# Altium schematic sheet USB.SchDoc
size A4
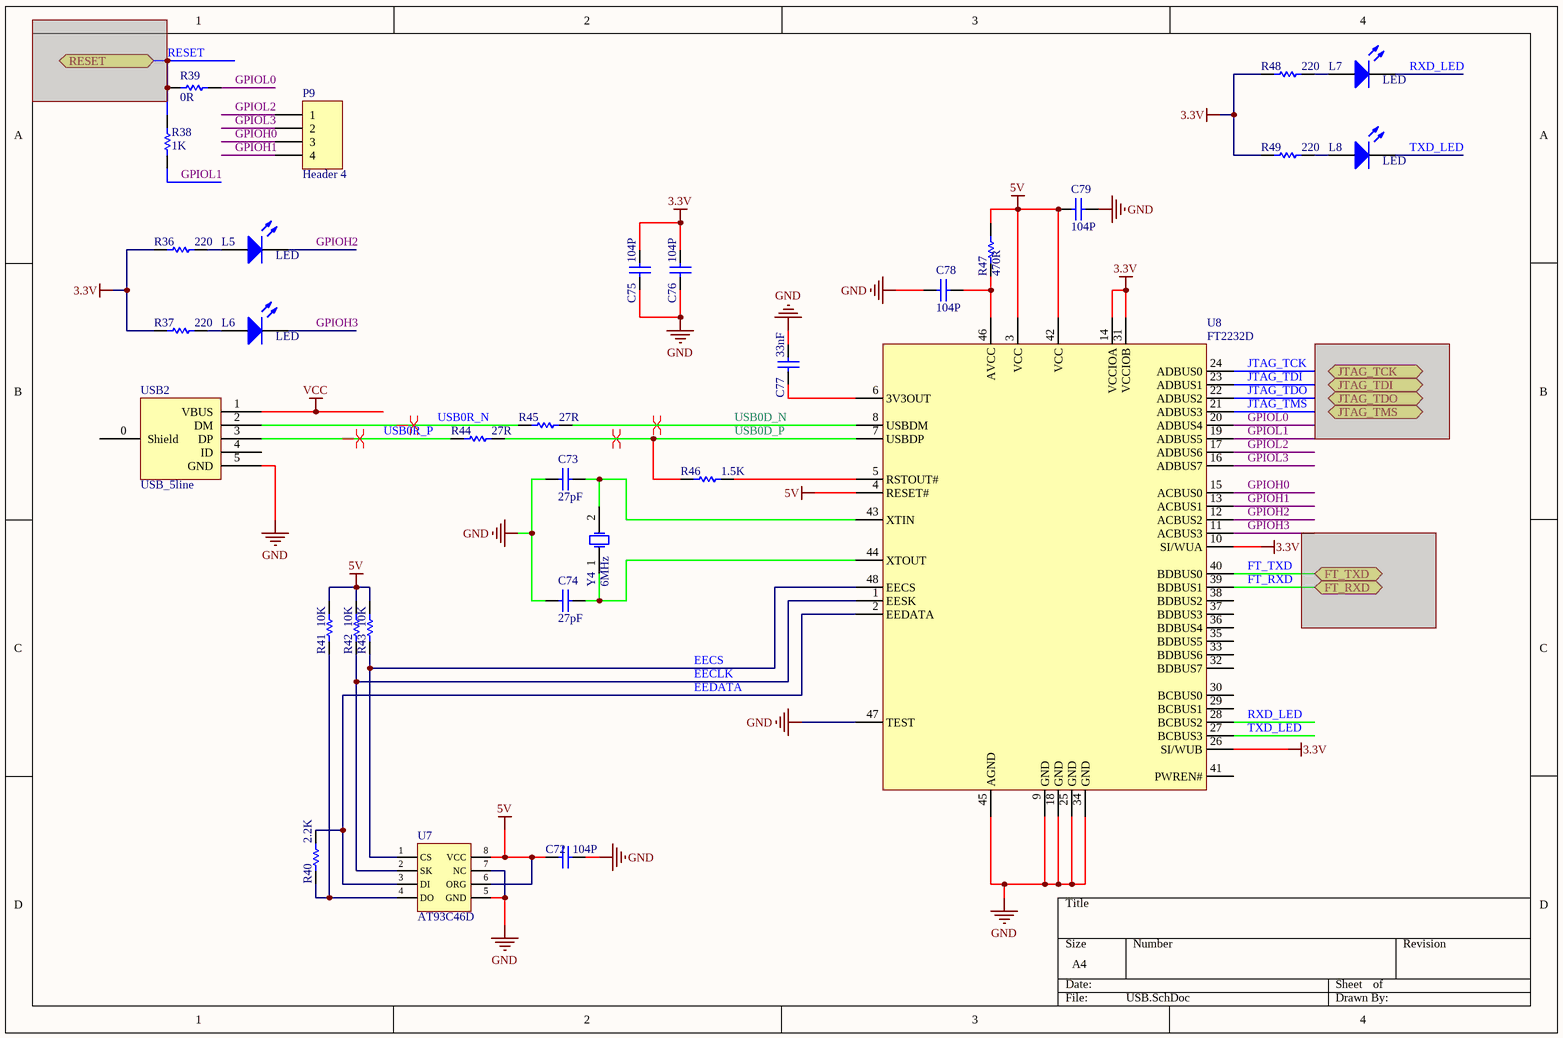
[diagram p0: USB.SchDoc]

## Parts
C72  value 104P  [1608[0603]]  (hidden comment: Cap)
C73  value 27pF  [1608[0603]]  (hidden comment: Cap)
C74  value 27pF  [1608[0603]]  (hidden comment: Cap)
C75  value 104P  [1608[0603]]  (hidden comment: Cap)
C76  value 104P  [1608[0603]]  (hidden comment: Cap)
C77  value 33nF  [1608[0603]]  (hidden comment: Cap)
C78  value 104P  [1608[0603]]  (hidden comment: Cap)
C79  value 104P  [1608[0603]]  (hidden comment: Cap)
L5  LED  [1608[0603]]
L6  LED  [1608[0603]]
L7  LED  [1608[0603]]
L8  LED  [1608[0603]]
P9  Header 4  [HDR1X4]
R36  value 220  [1608[0603]]  (hidden comment: Res)
R37  value 220  [1608[0603]]  (hidden comment: Res)
R38  value 1K  [1608[0603]]  (hidden comment: Res)
R39  value 0R  [1608[0603]]  (hidden comment: Res)
R40  value 2.2K  [1608[0603]]  (hidden comment: Res)
R41  value 10K  [1608[0603]]  (hidden comment: Res)
R42  value 10K  [1608[0603]]  (hidden comment: Res)
R43  value 10K  [1608[0603]]  (hidden comment: Res)
R44  value 27R  [1608[0603]]  (hidden comment: Res)
R45  value 27R  [1608[0603]]  (hidden comment: Res)
R46  value 1.5K  [1608[0603]]  (hidden comment: Res)
R47  value 470R  [1608[0603]]  (hidden comment: Res)
R48  value 220  [1608[0603]]  (hidden comment: Res)
R49  value 220  [1608[0603]]  (hidden comment: Res)
U7  AT93C46D  [TSOP65P640X120-8N-AT93C46D]
U8  FT2232D  [TSQFP50P900X900X160-48N]
USB2  USB_5line  [USB-MICRO-5P-2F]
Y4  6MHz  [XTAL-RAD-0.2]

## Ports
FT_RXD, FT_TXD, JTAG_TCK, JTAG_TDI, JTAG_TDO, JTAG_TMS, RESET

## Nets
3.3V: C75.2 C76.2 R36.2 R37.2 R48.2 R49.2 U8.10(SI/WUA) U8.14(VCCIOA) U8.26(SI/WUB) U8.31(VCCIOB)
5V: C72.2 C79.2 R41.1 R42.1 R43.1 R47.1 U7.6(ORG) U7.8(VCC) U8.3(VCC) U8.4(RESET#) U8.42(VCC)
GND: C72.1 C73.1 C74.2 C75.1 C76.1 C77.2 C78.2 C79.1 U7.5(GND) U7.7(NC) U8.9(GND) U8.18(GND) U8.25(GND) U8.34(GND) U8.45(AGND) U8.47(TEST) USB2.5(GND)
VCC: USB2.1(VBUS)
EECLK: R42.2 U7.2(SK) U8.1(EESK)
EECS: R43.2 U7.1(CS) U8.48(EECS)
EEDATA: R40.1 U7.3(DI) U8.2(EEDATA)
FT_RXD: U8.39(BDBUS1)
FT_TXD: U8.40(BDBUS0)
GPIOH0: P9.3 U8.15(ACBUS0)
GPIOH1: P9.4 U8.13(ACBUS1)
GPIOH2: L5.2(K) U8.12(ACBUS2)
GPIOH3: L6.2(K) U8.11(ACBUS3)
GPIOL0: R39.2 U8.20(ADBUS4)
GPIOL1: R38.2 U8.19(ADBUS5)
GPIOL2: P9.1 U8.17(ADBUS6)
GPIOL3: P9.2 U8.16(ADBUS7)
JTAG_TCK: U8.24(ADBUS0)
JTAG_TDI: U8.23(ADBUS1)
JTAG_TDO: U8.22(ADBUS2)
JTAG_TMS: U8.21(ADBUS3)
RXD_LED: L7.2(K) U8.28(BCBUS2)
TXD_LED: L8.2(K) U8.27(BCBUS3)
USB0D_N: R45.2 U8.8(USBDM)
USB0D_P: R44.2 R46.1 U8.7(USBDP)
USB0R_N: R45.1 USB2.2(DM)
USB0R_P: R44.1 USB2.3(DP)
NetC73_2: C73.2 U8.43(XTIN) Y4.2(OSC2)
NetC74_1: C74.1 U8.44(XTOUT) Y4.1(OSC1)
NetC77_1: C77.1 U8.6(3V3OUT)
NetC78_1: C78.1 R47.2 U8.46(AVCC)
NetL5_1: L5.1(A) R36.1
NetL6_1: L6.1(A) R37.1
NetL7_1: L7.1(A) R48.1
NetL8_1: L8.1(A) R49.1
NetR38_1: R38.1 R39.1
NetR40_2: R40.2 R41.2 U7.4(DO)
NetR46_2: R46.2 U8.5(RSTOUT#)

Not connected (* = marked no-connect by the designer): U8 29(BCBUS1) 30(BCBUS0) 32(BDBUS7) 33(BDBUS6) 35(BDBUS5) 36(BDBUS4) 37(BDBUS3) 38(BDBUS2) 41(PWREN#); USB2 0(Shield) 4(ID)

## Layout directives
differential pair: USB0D_N, USB0D_P, USB0R_N, USB0R_P

## Library data of the parts
C72-C79 = Cap: 贴片电容; Published: 8-Jun-2000; LatestRevisionDate: 17-Jul-2002; LatestRevisionNote: Re-released for DXP Platform.; PackageReference: RAD-0.3; Publisher: Altium Limited
P9 = Header 4: Header, 4-Pin; LatestRevisionDate: 17-Jul-2002; LatestRevisionNote: Re-released for DXP Platform.; Publisher: Altium Limited
R36-R49 = Res: 贴片电阻; Published: 8-Jun-2000; LatestRevisionDate: 17-Jul-2002; LatestRevisionNote: Re-released for DXP Platform.; PackageReference: AXIAL-0.3; Publisher: Altium Limited
Y4 = XTAL: 晶体振荡器; Published: 8-Jun-2000; LatestRevisionDate: 17-Jul-2002; LatestRevisionNote: Re-released for DXP Platform.; PackageReference: R38; Publisher: Altium Limited